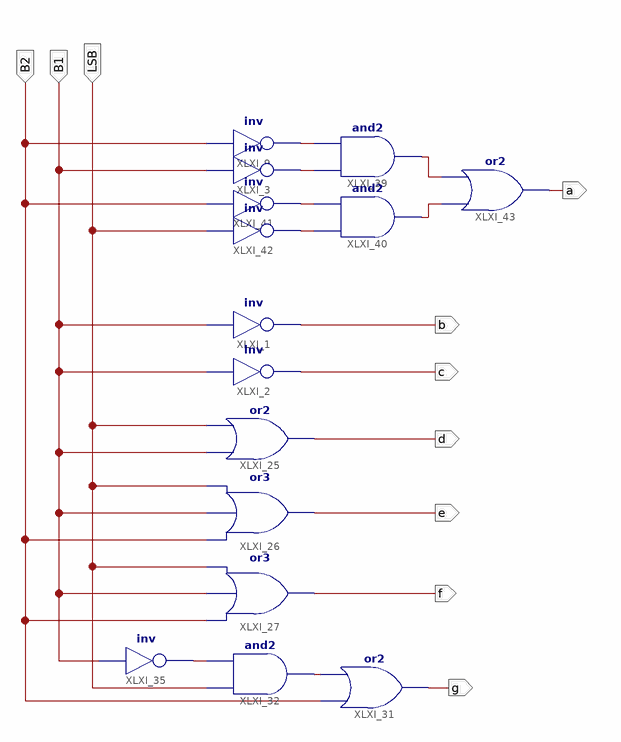
[diagram p0: schematic sheet 1]
// Xilinx ISE schematic SymbolDecoder.sch (spartan6) as structural Verilog: 15 symbols, 10 ports
module SymbolDecoder (
  input  B2,
  input  B1,
  input  LSB,
  output b,
  output c,
  output d,
  output e,
  output f,
  output g,
  output a
);

  wire XLXN_1, XLXN_2, XLXN_37, XLXN_43, XLXN_47, XLXN_48, XLXN_49, XLXN_50;

  not XLXI_1 (b, B1);
  not XLXI_2 (c, B1);
  or XLXI_25 (d, B1, LSB);
  or XLXI_26 (e, B2, B1, LSB);
  or XLXI_27 (f, B2, B1, LSB);
  and XLXI_32 (XLXN_37, LSB, XLXN_43);
  or XLXI_31 (g, B2, XLXN_37);
  not XLXI_35 (XLXN_43, B1);
  not XLXI_9 (XLXN_1, B2);
  not XLXI_3 (XLXN_2, B1);
  and XLXI_39 (XLXN_49, XLXN_2, XLXN_1);
  and XLXI_40 (XLXN_50, XLXN_48, XLXN_47);
  not XLXI_41 (XLXN_47, B2);
  not XLXI_42 (XLXN_48, LSB);
  or XLXI_43 (a, XLXN_50, XLXN_49);
endmodule
